# Altium schematic sheet Peripherals.SchDoc: Peripherals
size A4; DocumentNumber: MB1167; Revision: B.1; SheetNumber: 12; SheetTotal: 17; Project: STM327x6G-EVAL
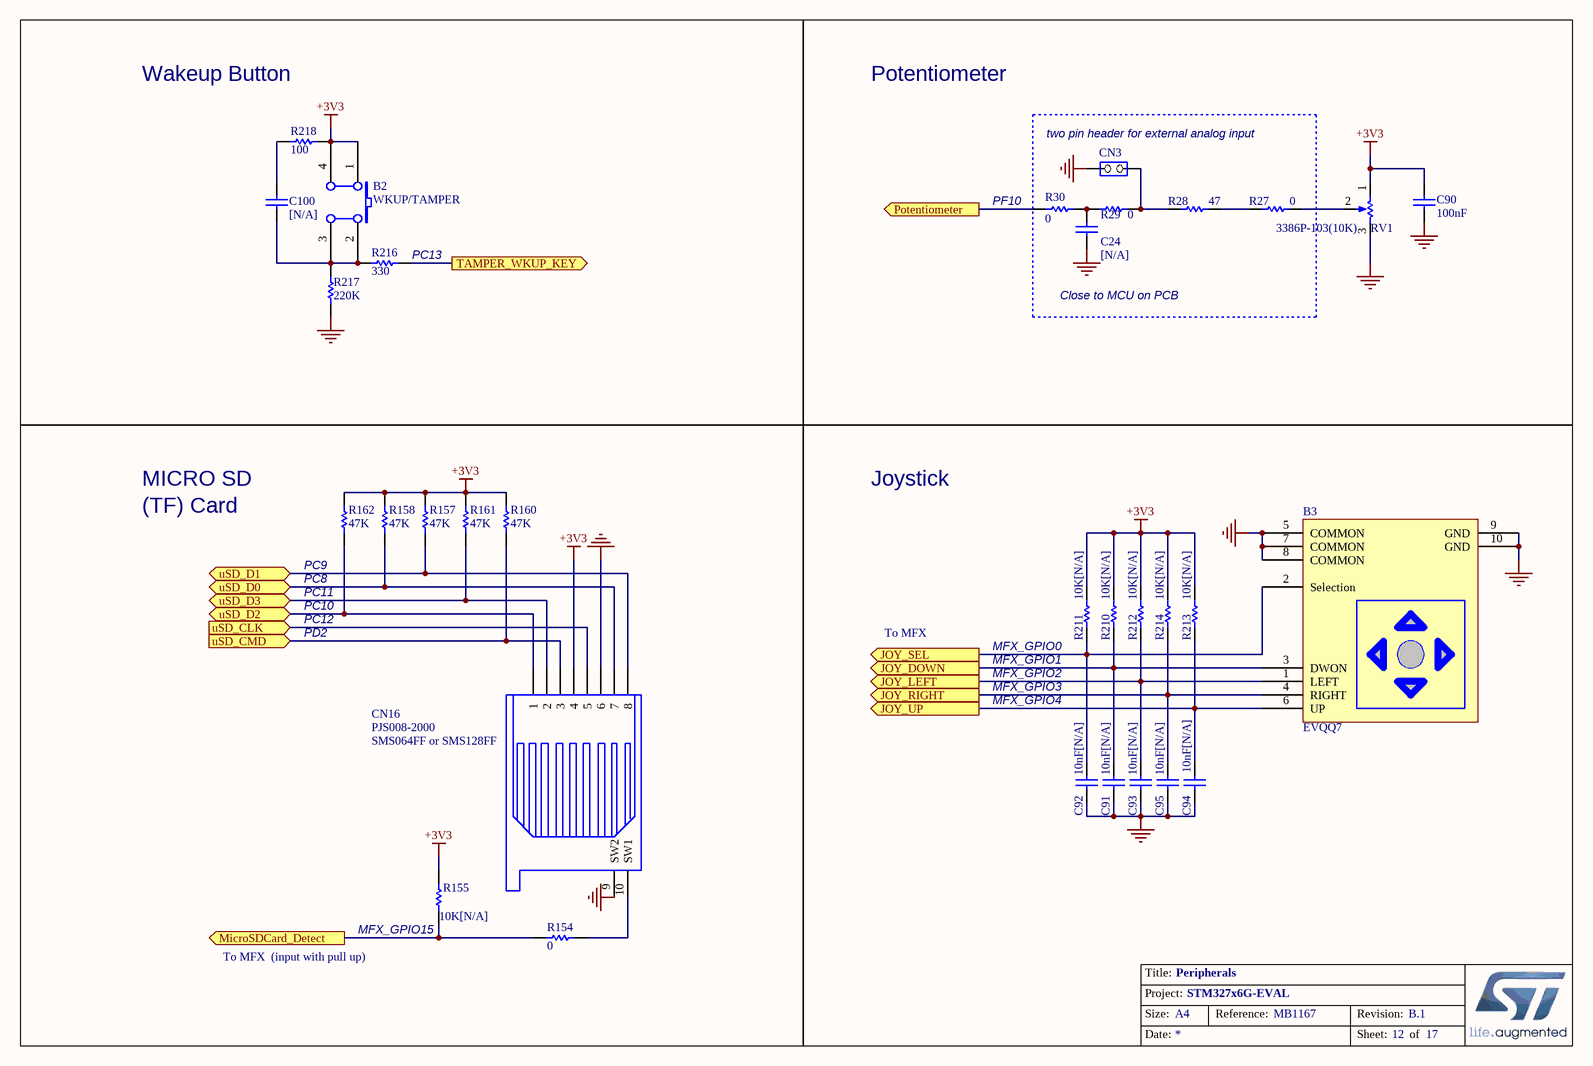
[diagram p0: Peripherals.SchDoc]

## Parts
B2  WKUP/TAMPER  [PB10]
B3  EVQQ7  [SW-JOY]
C24  [N/A]  [0603C]
C90  100nF  [0603C]
C91  10nF[N/A]  [0603C]
C92  10nF[N/A]  [0603C]
C93  10nF[N/A]  [0603C]
C94  10nF[N/A]  [0603C]
C95  10nF[N/A]  [0603C]
C100  [N/A]  [0603C]
CN3  (no value)  [SIP2]
CN16  PJS008-2000  [MSD_PJS008_]
R27  0  [0603R]
R28  47  [0603R]
R29  0  [0603R]
R30  0  [0603R]
R154  0  [0603R]
R155  10K[N/A]  [0603R]
R157  47K  [0603R]
R158  47K  [0603R]
R160  47K  [0603R]
R161  47K  [0603R]
R162  47K  [0603R]
R210  10K[N/A]  [0603R]
R211  10K[N/A]  [0603R]
R212  10K[N/A]  [0603R]
R213  10K[N/A]  [0603R]
R214  10K[N/A]  [0603R]
R216  330  [0603R]
R217  220K  [0603R]
R218  100  [0603R]
RV1  3386P-103(10K)  [3386P]

## Ports
JOY_DOWN (out), JOY_LEFT (out), JOY_RIGHT (out), JOY_SEL (out), JOY_UP (out), MicroSDCard_Detect (out), Potentiometer (out), TAMPER_WKUP_KEY (out), uSD_CLK (in), uSD_CMD (in), uSD_D0 (bidir), uSD_D1 (bidir), uSD_D2 (bidir), uSD_D3 (bidir)

## Nets
+3V3: B2.1(A0) B2.4(A1) C90.1 CN16.4 R155.2 R157.1 R158.1 R160.1 R161.1 R162.1 R210.1 R211.1 R212.1 R213.1 R214.1 R218.1 RV1.1(BOT)
GND: B3.5(COMMON) B3.7(COMMON) B3.8(COMMON) B3.9(GND) B3.10(GND) C24.1 C90.2 C91.1 C92.1 C93.1 C94.1 C95.1 CN3.2(NO) CN16.6 CN16.9(SW2) R217.2 RV1.3(TOP)
JOY_DOWN: B3.3(DWON) C91.2 R210.2 ; port JOY_DOWN
JOY_LEFT: B3.1(LEFT) C93.2 R212.2 ; port JOY_LEFT
JOY_RIGHT: B3.4(RIGHT) C95.2 R214.2 ; port JOY_RIGHT
JOY_SEL: B3.2(Selection) C92.2 R211.2 ; port JOY_SEL
JOY_UP: B3.6(UP) C94.2 R213.2 ; port JOY_UP
MicroSDCard_Detect: R154.1 R155.1 ; port MicroSDCard_Detect
Potentiometer: R30.2 ; port Potentiometer
TAMPER_WKUP_KEY: R216.2 ; port TAMPER_WKUP_KEY
uSD_CLK: CN16.5 ; port uSD_CLK
uSD_CMD: CN16.3 R160.2 ; port uSD_CMD
uSD_D0: CN16.7 R158.2 ; port uSD_D0
uSD_D1: CN16.8 R157.2 ; port uSD_D1
uSD_D2: CN16.1 R162.2 ; port uSD_D2
uSD_D3: CN16.2 R161.2 ; port uSD_D3
NetB2_2: B2.2(B0) B2.3(B1) C100.2 R216.1 R217.1
NetC24_2: C24.2 R29.1 R30.1
NetC100_1: C100.1 R218.2
NetCN3_1: CN3.1(COMMON) R28.1 R29.2
NetCN16_10: CN16.10(SW1) R154.2
NetR27_1: R27.1 R28.2
NetR27_2: R27.2 RV1.2(TAP)

## Notes on the sheet
- Wakeup Button
- Potentiometer
- (near CN3) two pin header for external analog input
- (near R216) PC13
- (near R30) PF10
- Close to MCU on PCB
- MICRO SD
- (TF) Card
- Joystick
- (near R162) PC8
- (near R162) PC9
- PC11
- PC10
- PC12
- PD2
- To MFX
- (near R211) MFX_GPIO0
- MFX_GPIO1
- MFX_GPIO2
- MFX_GPIO3
- MFX_GPIO4
- (near CN16) SMS064FF or SMS128FF
- (near R155) MFX_GPIO15
- To MFX  (input with pull up)
- Title:
- Project:
- Size:
- Date:
- A4
- Reference:
- Sheet:
- Revision:
- of

## Library data of the parts
B2 = SW PUSHBUTTON: SE PUSHBUTTON
C24 = cap: Capacitor; Value: 100pF; Published: 8-Jun-2000; Revision: July-2002: Re-released for DXP Platform.; Publisher: Altium Limited
C90-C95 C100 = CAP: Capacitor; Value: 100pF; Published: 8-Jun-2000; Revision: July-2002: Re-released for DXP Platform.; Publisher: Altium Limited
CN3 = JP2
CN16 = SMS016AFA5E
R27-R30 R154 R155 R216 R218 = Res1: Resistor; Value: 1K; Published: 8-Jun-2000; Revision: July-2002: Re-released for DXP Platform.; Publisher: Altium Limited
R157 R158 R160-R162 R210-R214 R217 = res1: Resistor; Value: 1K; Published: 8-Jun-2000; Revision: July-2002: Re-released for DXP Platform.; Publisher: Altium Limited
RV1 = RV